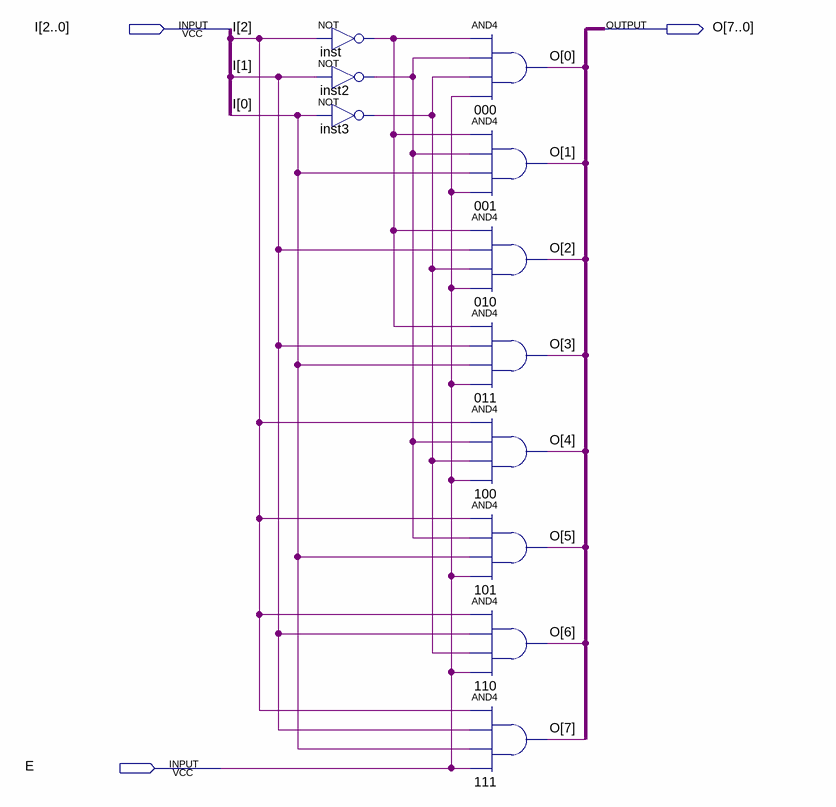
[diagram p0: schematic sheet]
// Quartus schematic DEC_3_TO_8.bdf as structural Verilog: 11 symbols, 3 pins
module DEC_3_TO_8 (
  input  [2:0] I,
  input  E,
  output [7:0] O
);

  wire inst2_out, inst3_out, inst_out;

  not inst (inst_out, I[2]);
  not inst2 (inst2_out, I[1]);
  not inst3 (inst3_out, I[0]);
  and u_000 (O[0], inst_out, inst2_out, inst3_out, E);
  and u_001 (O[1], inst_out, inst2_out, I[0], E);
  and u_010 (O[2], inst_out, I[1], inst3_out, E);
  and u_011 (O[3], inst_out, I[1], I[0], E);
  and u_100 (O[4], I[2], inst2_out, inst3_out, E);
  and u_101 (O[5], I[2], inst2_out, I[0], E);
  and u_110 (O[6], I[2], I[1], inst3_out, E);
  and u_111 (O[7], I[2], I[1], I[0], E);
endmodule
